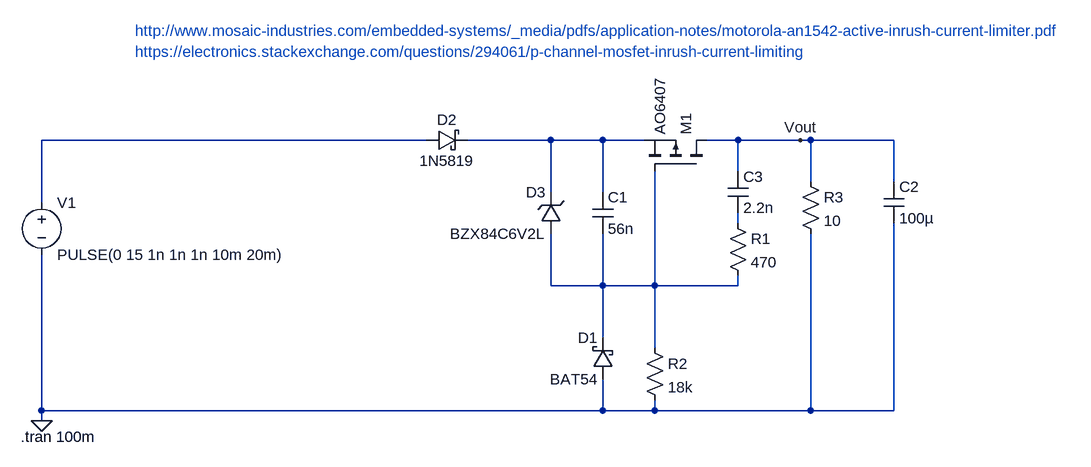
[diagram p0: schematic softStart.asc]
softStart.asc, the LTspice schematic file:
Version 4
SHEET 1 1252 680
WIRE 80 48 -512 48
WIRE 272 48 144 48
WIRE 352 48 272 48
WIRE 416 48 352 48
WIRE 560 48 512 48
WIRE 656 48 560 48
WIRE 672 48 656 48
WIRE 800 48 672 48
WIRE 560 96 560 48
WIRE 672 112 672 48
WIRE 800 112 800 48
WIRE 272 128 272 48
WIRE 352 128 352 48
WIRE -512 144 -512 48
WIRE 560 176 560 160
WIRE 272 272 272 192
WIRE 352 272 352 192
WIRE 352 272 272 272
WIRE 432 272 432 96
WIRE 432 272 352 272
WIRE 560 272 560 256
WIRE 560 272 432 272
WIRE 352 352 352 272
WIRE 432 368 432 272
WIRE -512 464 -512 224
WIRE 352 464 352 416
WIRE 352 464 -512 464
WIRE 432 464 432 448
WIRE 432 464 352 464
WIRE 672 464 672 192
WIRE 672 464 432 464
WIRE 800 464 800 176
WIRE 800 464 672 464
WIRE -512 480 -512 464
FLAG -512 480 0
FLAG 656 48 Vout
SYMBOL voltage -512 128 R0
WINDOW 123 0 0 Left 0
WINDOW 39 0 0 Left 0
SYMATTR InstName V1
SYMATTR Value PULSE(0 15 1n 1n 1n 10m 20m)
SYMBOL pmos 512 96 M270
SYMATTR InstName M1
SYMATTR Value AO6407
SYMBOL res 656 96 R0
SYMATTR InstName R3
SYMATTR Value 10
SYMBOL res 416 352 R0
SYMATTR InstName R2
SYMATTR Value 18k
SYMBOL cap 784 112 R0
SYMATTR InstName C2
SYMATTR Value 100µ
SYMBOL schottky 80 64 R270
WINDOW 0 32 32 VTop 2
WINDOW 3 0 32 VBottom 2
SYMATTR InstName D2
SYMATTR Value 1N5819
SYMATTR Description Diode
SYMATTR Type diode
SYMBOL cap 336 128 R0
SYMATTR InstName C1
SYMATTR Value 56n
SYMBOL cap 544 96 R0
SYMATTR InstName C3
SYMATTR Value 2.2n
SYMBOL res 544 160 R0
SYMATTR InstName R1
SYMATTR Value 470
SYMBOL schottky 368 416 R180
WINDOW 0 24 64 Left 2
WINDOW 3 24 0 Left 2
SYMATTR InstName D1
SYMATTR Value BAT54
SYMATTR Description Diode
SYMATTR Type diode
SYMBOL zener 288 192 R180
WINDOW 0 24 64 Left 2
WINDOW 3 24 0 Left 2
SYMATTR InstName D3
SYMATTR Value BZX84C6V2L
SYMATTR Description Diode
SYMATTR Type diode
TEXT -544 504 Left 2 !.tran 100m
TEXT -368 -88 Left 2 ;https://electronics.stackexchange.com/questions/294061/p-channel-mosfet-inrush-current-limiting
TEXT -368 -120 Left 2 ;http://www.mosaic-industries.com/embedded-systems/_media/pdfs/application-notes/motorola-an1542-active-inrush-current-limiter.pdf

The netlist it stands for:
* softStart.asc
V1 N001 0 PULSE(0 15 1n 1n 1n 10m 20m)
M1 Vout N004 N002 N002 AO6407
R3 Vout 0 10
R2 N004 0 18k
C2 Vout 0 100µ
D2 N001 N002 1N5819
C1 N002 N004 56n
C3 Vout N003 2.2n
R1 N003 N004 470
D1 0 N004 BAT54
D3 N004 N002 BZX84C6V2L
.model D D
.lib standard.dio
.model NMOS NMOS
.model PMOS PMOS
.lib standard.mos
.tran 100m
* https://electronics.stackexchange.com/questions/294061/p-channel-mosfet-inrush-current-limiting
* http://www.mosaic-industries.com/embedded-systems/_media/pdfs/application-notes/motorola-an1542-active-inrush-current-limiter.pdf
.backanno
.end